# Altium schematic sheet SOC_FLASH.schdoc: =
size A3; Symbol: Sheet-Symbol_A4; Company: 嘉立创EDA; Version: V1.0; Page Size: A4; @Project Name: RK3568_LPD4X_120P_Core; @Page Count: 18; @Update Date: 2025-08-24; @Create Date: 2025-08-15; @Schematic Name: Schematic1; @Page No: 7; @Page Name: SOC_FLASH; Device: Sheet-Symbol_A4; Border: 1; Title Block Position: 3; Width: 1655; Height: 1170; Region Start: 1; X Region Count: 6; Y Region Count: 4; Blade Width: 10; @Board Name: Board1; @Create Time: 13:45:50; @Update Time: 13:20:27; Organization: ORGANIZATION; Address1: ADDRESS 1; Address2: ADDRESS 2; Address3: ADDRESS 3; Address4: ADDRESS 4; SheetNumber: 13; SheetTotal: 28
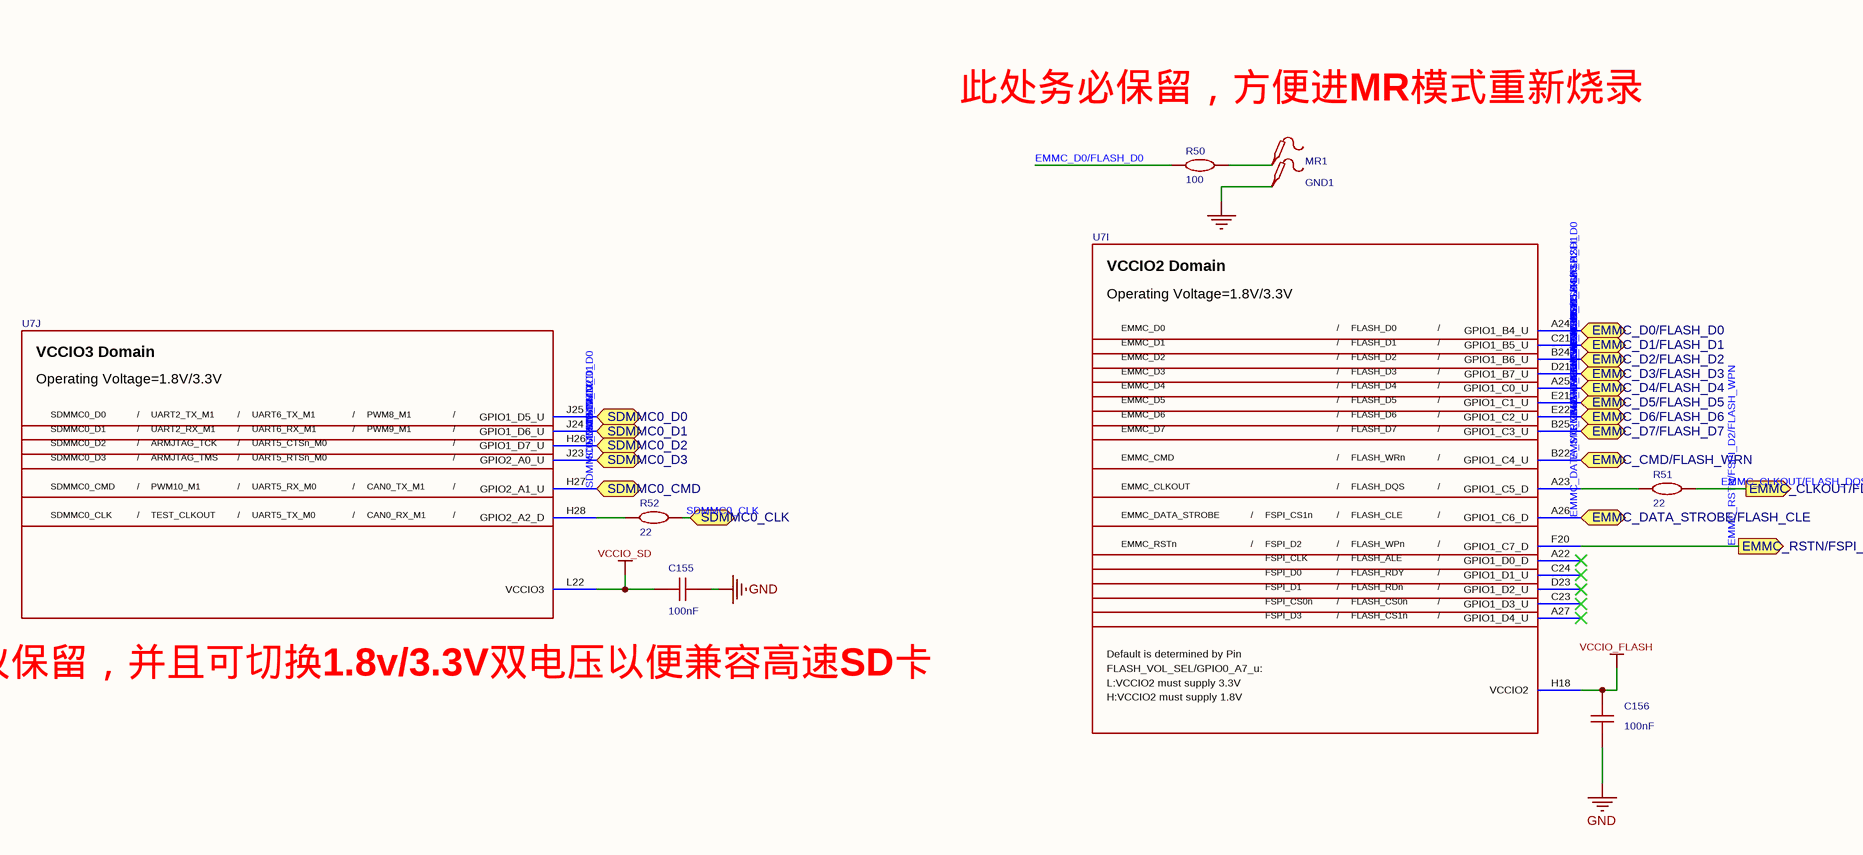
[diagram p0: SOC_FLASH.schdoc]

## Parts
C155  100nF  [C0201]
C156  100nF  [C0201]
GND1  (no value)  [Test-Point-0.5mm]
MR1  (no value)  [Test-Point-0.5mm]
R50  100  [R0402]
R51  22  [R0402]
R52  22  [R0402]
U7  RK3568  [BGA-636_L19.0-W19.0-P0.65-BL]  (value not drawn)  (parts I,J of 23)

## Ports
EMMC_CLKOUT/FLASH_DQS (out), EMMC_CMD/FLASH_WRN (bidir), EMMC_D0/FLASH_D0 (bidir), EMMC_D1/FLASH_D1 (bidir), EMMC_D2/FLASH_D2 (bidir), EMMC_D3/FLASH_D3 (bidir), EMMC_D4/FLASH_D4 (bidir), EMMC_D5/FLASH_D5 (bidir), EMMC_D6/FLASH_D6 (bidir), EMMC_D7/FLASH_D7 (bidir), EMMC_DATA_STROBE/FLASH_CLE (bidir), EMMC_RSTN/FSPI_D2/FLASH_WPN (out), SDMMC0_CLK (bidir), SDMMC0_CMD (bidir), SDMMC0_D0 (bidir), SDMMC0_D1 (bidir), SDMMC0_D2 (bidir), SDMMC0_D3 (bidir)

## Nets
GND: C155.1 C156.1 GND1.1
VCCIO_FLASH: C156.2 U7.H18(VCCIO2)
VCCIO_SD: C155.2 U7.L22(VCCIO3)
EMMC_CLKOUT/FLASH_DQS: R51.2 ; port EMMC_CLKOUT/FLASH_DQS
EMMC_CMD/FLASH_WRN: U7.B22(GPIO1_C4_U) ; port EMMC_CMD/FLASH_WRN
EMMC_D0/FLASH_D0: R50.1 U7.A24(GPIO1_B4_U) ; port EMMC_D0/FLASH_D0
EMMC_D1/FLASH_D1: U7.C21(GPIO1_B5_U) ; port EMMC_D1/FLASH_D1
EMMC_D2/FLASH_D2: U7.B24(GPIO1_B6_U) ; port EMMC_D2/FLASH_D2
EMMC_D3/FLASH_D3: U7.D21(GPIO1_B7_U) ; port EMMC_D3/FLASH_D3
EMMC_D4/FLASH_D4: U7.A25(GPIO1_C0_U) ; port EMMC_D4/FLASH_D4
EMMC_D5/FLASH_D5: U7.E21(GPIO1_C1_U) ; port EMMC_D5/FLASH_D5
EMMC_D6/FLASH_D6: U7.E22(GPIO1_C2_U) ; port EMMC_D6/FLASH_D6
EMMC_D7/FLASH_D7: U7.B25(GPIO1_C3_U) ; port EMMC_D7/FLASH_D7
EMMC_DATA_STROBE/FLASH_CLE: U7.A26(GPIO1_C6_D) ; port EMMC_DATA_STROBE/FLASH_CLE
EMMC_RSTN/FSPI_D2/FLASH_WPN: U7.F20(GPIO1_C7_D) ; port EMMC_RSTN/FSPI_D2/FLASH_WPN
SDMMC0_CLK: R52.2 ; port SDMMC0_CLK
SDMMC0_CMD: U7.H27(GPIO2_A1_U) ; port SDMMC0_CMD
SDMMC0_D0: U7.J25(GPIO1_D5_U) ; port SDMMC0_D0
SDMMC0_D1: U7.J24(GPIO1_D6_U) ; port SDMMC0_D1
SDMMC0_D2: U7.H26(GPIO1_D7_U) ; port SDMMC0_D2
SDMMC0_D3: U7.J23(GPIO2_A0_U) ; port SDMMC0_D3
NetMR1_1: MR1.1 R50.2
NetR51_1: R51.1 U7.A23(GPIO1_C5_D)
NetR52_1: R52.1 U7.H28(GPIO2_A2_D)

Not connected (* = marked no-connect by the designer): U7 A22(GPIO1_D0_D)* A27(GPIO1_D4_U)* C23(GPIO1_D3_U)* C24(GPIO1_D1_U)* D23(GPIO1_D2_U)*

## Notes on the sheet
- 此处务必保留，方便进MR模式重新烧录
- 此处建议保留，并且可切换1.8v/3.3V双电压以便兼容高速SD卡
- Drawn By :
- Checked By :
- Approved By :
- SheetNumber
- SheetTotal
- Revision :
- Time :
- Size :
- Date :
- A3
- DocumentName :
- Project :
- (in symbol RK3568, part I) VCCIO2 Domain; Operating Voltage=1.8V/3.3V; EMMC_D0; /; FLASH_D0; EMMC_D1; FLASH_D1; EMMC_D2; FLASH_D2; EMMC_D3; FLASH_D3; EMMC_D4; FLASH_D4; EMMC_D5; FLASH_D5; EMMC_D6; FLASH_D6; EMMC_D7; FLASH_D7; EMMC_CMD; FLASH_WRn; EMMC_CLKOUT; FLASH_DQS; EMMC_DATA_STROBE; FSPI_CS1n; FLASH_CLE; EMMC_RSTn; FSPI_D2; FLASH_WPn; FSPI_CLK; FLASH_ALE; FSPI_D0; FLASH_RDY; FSPI_D1; FLASH_RDn; FSPI_CS0n; FLASH_CS0n; FSPI_D3; FLASH_CS1n; Default is determined by Pin; FLASH_VOL_SEL/GPIO0_A7_u:; L:VCCIO2 must supply 3.3V; H:VCCIO2 must supply 1.8V
- (in symbol RK3568, part J) VCCIO3 Domain; Operating Voltage=1.8V/3.3V; SDMMC0_D0; /; UART2_TX_M1; UART6_TX_M1; PWM8_M1; SDMMC0_D1; UART2_RX_M1; UART6_RX_M1; PWM9_M1; SDMMC0_D2; ARMJTAG_TCK; UART5_CTSn_M0; SDMMC0_D3; ARMJTAG_TMS; UART5_RTSn_M0; SDMMC0_CMD; PWM10_M1; UART5_RX_M0; CAN0_TX_M1; SDMMC0_CLK; TEST_CLKOUT; UART5_TX_M0; CAN0_RX_M1

## Library data of the parts
C155 C156 = GRM035R60J475ME15D: 容值:4.7uF;精度:±20%;额定电压:6.3V;温度系数:X5R;; Manufacturer: muRata(村田); AddInBom: yes; ModelId: e8033a7cb35143ffb28e3b81b2577ea0; ModelName: C0201_L0.6-W0.3-H0.3; ModelTransform: 23.622,11.811,0,0,0,0,0,0,0; Tolerance: ±20%; Voltage Rating: 6.3V; Temperature Coefficient: X5R; Symbol: GRM035R60J475ME15D; Value: 100nF; Device: GRM035R60J475ME15D; LCSC Part Name: 4.7uF ±20% 6.3V; ManufacturerPart: GRM035R60J475ME15D; Supplier Footprint: 0201; JLCPCB Part Class: Extended Part; Datasheet: https://item.szlcsc.com/datasheet/GRM035R60J475ME15D/313624.html; Supplier: LCSC; ConvertToPcb: yes; FootprintName: C0201
GND1 MR1 = Test-Point: Test Point 测试点; AddInBom: yes; Device: Test-Point; ConvertToPcb: yes; SymbolName: Test-Point; FootprintName: Test-Point-0.5mm
R50 = Res_0402: Symbol: 电阻; ConvertToPcb: yes; ModelId: 671aefced39d4c318694bba8bd8efd39; ModelName: R0402_L1.0-W0.5-H0.5; ModelTransform: 39.37,19.685,0,0,0,0,0,0.0005,0; Value: 100; Device: Res_0402; AddInBom: yes; Supplier Footprint: 0402; FootprintName: R0402
R51 R52 = Res_0402: Symbol: 电阻; 3D Model: 671aefced39d4c318694bba8bd8efd39; 3D Model Transform: 39.37,19.685,0,0,0,0,0,0.0005,0; ConvertToPcb: yes; ModelName: R0402_L1.0-W0.5-H0.5; Device: Res_0402; Supplier Footprint: 0402; Value: 22; AddInBom: yes; FootprintName: R0402
U7 = RK3568: ConvertToPcb: yes; ModelId: e6756cba1b9f43448429fdcd1d44d9d9; ModelTransform: 748.03,748.03,54.33,0,0,0,0,0,0; Symbol: RK3568; Device: RK3568; AddInBom: yes; FootprintName: BGA-636_L19.0-W19.0-P0.65-BL; ModelName: BGA-636_L19.0-W19.0-P0.65-BL